# EAGLE design attiny84_bo (EAGLE 6.2)
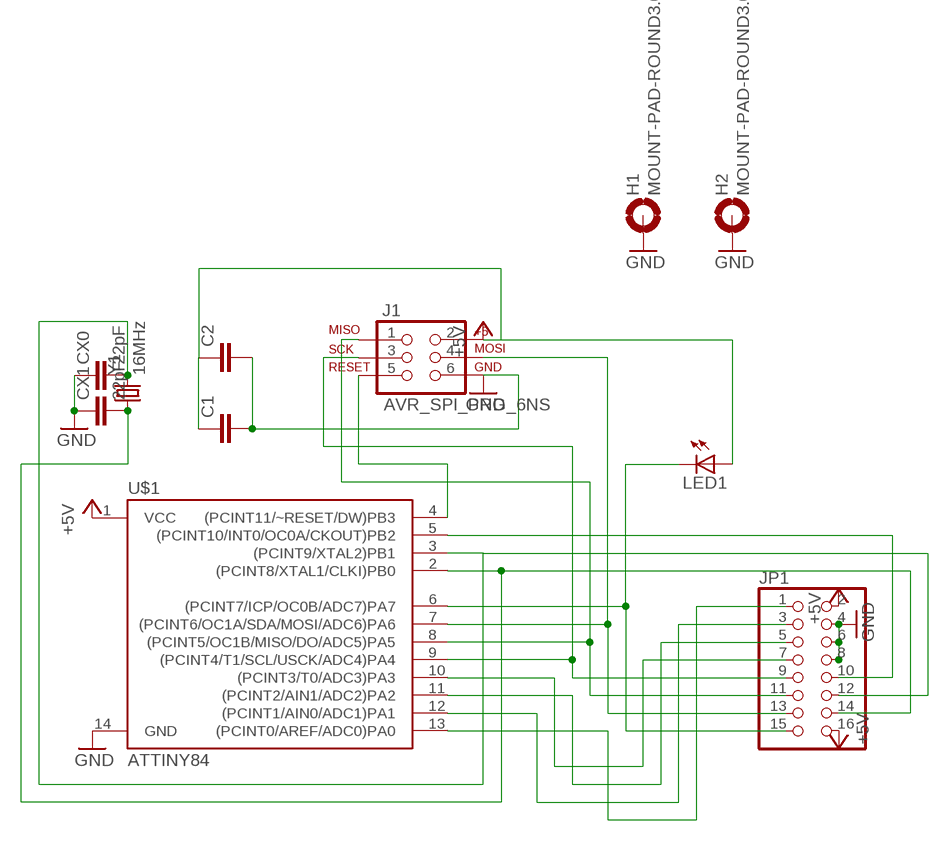
[diagram p0: schematic, sheet 1]

## Parts
C1  C-EUC0805  [C0805]
C2  C-EUC0805  [C0805]
CX0  22pF  C-EUC0603  [C0603]
CX1  22pF  C-EUC0603  [C0603]
H1  MOUNT-PAD-ROUND3.0  [3,0-PAD]
H2  MOUNT-PAD-ROUND3.0  [3,0-PAD]
J1  AVR_SPI_PRG_6NS  [2X3-NS]
JP1  PINHD-2X8  [2X08]
LED1  LED0603  [LED-0603]
U$1  ATTINY84  [SO14]
Y1  16MHz  CRYSTAL5X3  [CRYSTAL-SMD-5X3]

## Nets
+5V [POWER]: C1.1 C2.1 J1.2 JP1.2 JP1.16 LED1.A U$1.1(VCC)
GND [POWER]: C1.2 C2.2 CX0.1 CX1.1 H1.B3,0(MOUNT) H2.B3,0(MOUNT) J1.6 JP1.4 JP1.6 JP1.8 U$1.14(GND)
PA0: JP1.1 U$1.13((PCINT0/AREF/ADC0)PA0)
PA1: JP1.3 U$1.12((PCINT1/AIN0/ADC1)PA1)
PA2: JP1.5 U$1.11((PCINT2/AIN1/ADC2)PA2)
PA3: JP1.7 U$1.10((PCINT3/T0/ADC3)PA3)
PA4/SCL: J1.3 JP1.9 U$1.9((PCINT4/T1/SCL/USCK/ADC4)PA4)
PA5/MISO: J1.1 JP1.11 U$1.8((PCINT5/OC1B/MISO/DO/ADC5)PA5)
PA6/MOSI: J1.4 JP1.13 U$1.7((PCINT6/OC1A/SDA/MOSI/ADC6)PA6)
PA7: JP1.15 LED1.C U$1.6((PCINT7/ICP/OC0B/ADC7)PA7)
PB0/XTAL1: CX1.2 JP1.14 U$1.2((PCINT8/XTAL1/CLKI)PB0) Y1.1
PB1/XTAL2: CX0.2 JP1.12 U$1.3((PCINT9/XTAL2)PB1) Y1.3
PB2: JP1.10 U$1.5((PCINT10/INT0/OC0A/CKOUT)PB2)
PB3/RESET-: J1.5 U$1.4((PCINT11/~RESET/DW)PB3)

## Library data of the parts
C1 C2 CX0 CX1 = rcl:C-EU: CAPACITOR, European symbol
H1 H2 = holes:MOUNT-PAD-ROUND: MOUNTING PAD, round
J1 = SparkFun-Connectors:AVR_SPI_PRG_6: AVR ISP 6 Pin This is the reduced ISP connector for AVR programming. Common on Arduino. This footprint will take up less PCB space and can be used with a 10-pin to 6-pin adapter such as SKU: BOB-08508
JP1 = pinhead:PINHD-2X8: PIN HEADER
LED1 = SparkFun-LED:LED: LEDs Standard schematic elements and footprints for 5mm, 3mm, 1206, and 0603 sized LEDs. 5mm - Spark Fun Electronics SKU : COM-00529 (and others)
U$1 = SparkFun-DigitalIC:ATTINY84: Atmel 14-pin 2/4/8kB flash uC
Y1 = SparkFun-FreqCtrl:CRYSTAL: Various standard crystals. Proven footprints. Spark Fun Electronics SKU : COM-00534

## Net classes
1 POWER: width 0.254 mm

## Board
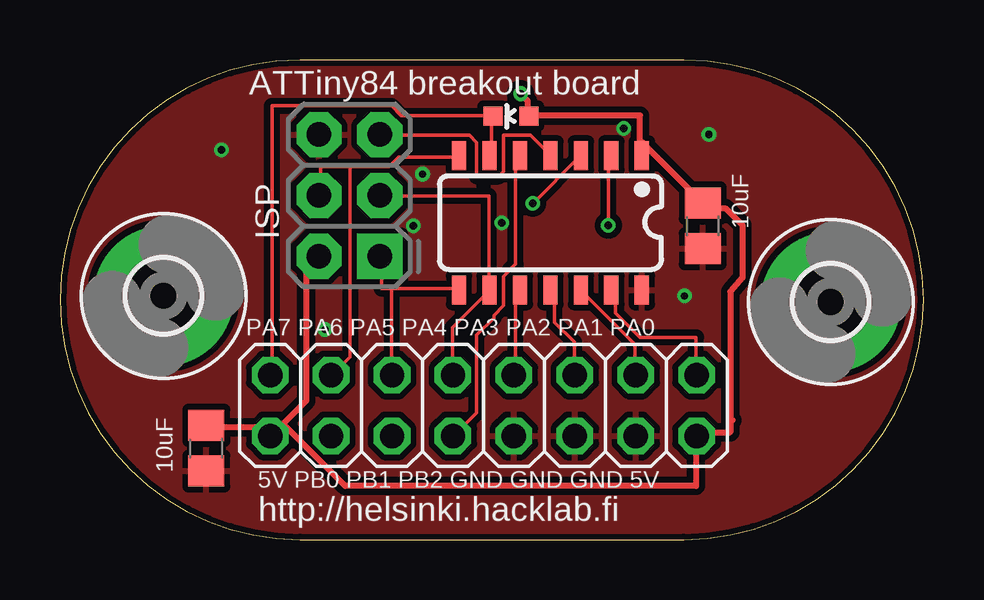
[diagram p1: board, top side]
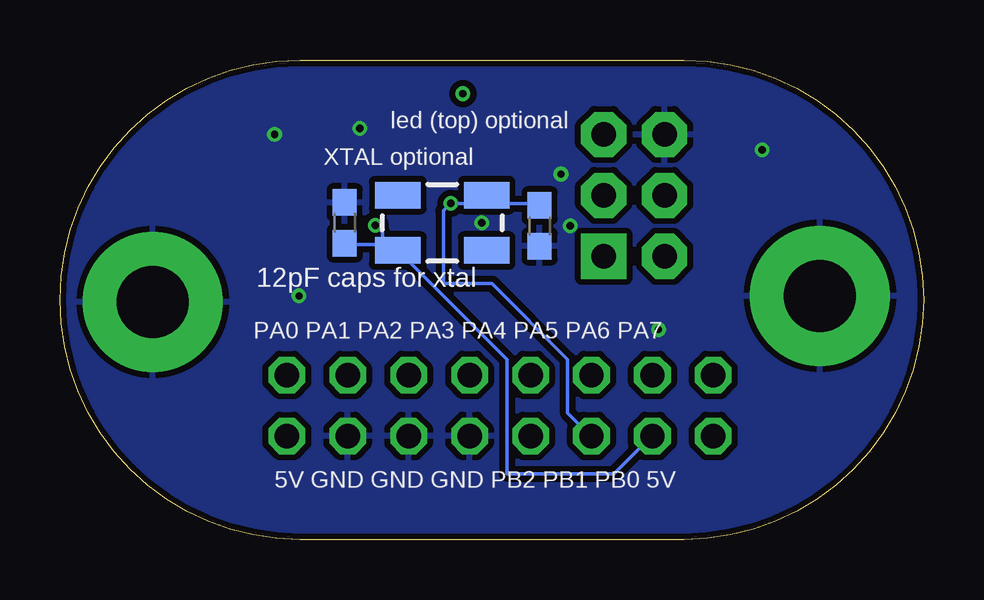
[diagram p2: board, bottom side, seen from below]

Size 36 x 20 mm. Coordinates in mm from the lower left corner, seen from the top.
Outline: 10,20 arc180 10,0 26,0 arc180 26,20 10,20
Copper layers (1*16): Top 0.035mm / dielectric 1.5mm / Bottom 0.035mm
Design rules "default": minimum track width 6mil, minimum drill 12mil, track to track 6mil, track to pad 6mil, pad to pad 6mil, via to via 6mil, smd to smd 0mil, copper to edge 10mil, drill to drill 10mil, minimum pad ring 10mil, minimum via ring 6mil, stop-mask expansion 2mil, vias tented up to drill 100mil, thermal gap 10mil

### Footprints (pad centres in the part's own frame; a part is rotated, then mirrored left to right if it is on the bottom)
C0805 = smd 1.3 x 1.5: 1 -0.95,0; 2 0.95,0
C0603 = smd 1.1 x 1: 1 -0.85,0; 2 0.85,0
3,0-PAD = drill 3 pad 5.842: B3,0 0,0
2X3-NS = drill 1.016 pad 1.88 square: 1 -2.54,-1.27 | drill 1.016 pad 1.88 octagon: 2 -2.54,1.27; 3 0,-1.27; 4 0,1.27; 5 2.54,-1.27; 6 2.54,1.27
2X08 = drill 1.016 octagon: 1 -8.89,-1.27; 2 -8.89,1.27; 3 -6.35,-1.27; 4 -6.35,1.27; 5 -3.81,-1.27; 6 -3.81,1.27; 7 -1.27,-1.27; 8 -1.27,1.27; 9 1.27,-1.27; 10 1.27,1.27; 11 3.81,-1.27; 12 3.81,1.27; 13 6.35,-1.27; 14 6.35,1.27; 15 8.89,-1.27; 16 8.89,1.27
LED-0603 = smd 0.8 x 0.8: A 0,-0.75; C 0,0.75
SO14 = smd 0.6 x 1.2: 1 -3.81,-2.8; 2 -2.54,-2.8; 3 -1.27,-2.8; 4 0,-2.8; 5 1.27,-2.8; 6 2.54,-2.8; 7 3.81,-2.8; 8 3.81,2.8; 9 2.54,2.8; 10 1.27,2.8; 11 0,2.8; 12 -1.27,2.8; 13 -2.54,2.8; 14 -3.81,2.8
CRYSTAL-SMD-5X3 = smd 1.9 x 1.1: 1 -1.85,-1.15; 2 1.85,-1.15; 3 1.85,1.15; 4 -1.85,1.15

### Placement (x,y rotation side)
C1  26.8,13.08 270 top
C2  6.1,3.81 270 top
CX0  16,13.08 90 bottom
CX1  24.13,13.21 270 bottom
H1  4.32,10.16 0 top
H2  32.13,9.91 0 top
J1  12.06,14.35 90 top
JP1  17.65,5.59 180 top
LED1  18.8,17.65 90 top
U$1  20.45,13.21 180 top
Y1  20.07,13.21 0 bottom

### Tracks (layer width: path | path; a pad name or v marks a point on that pad's centre or on a via)
+5V  (via drill 0.3)
  Top 0.254: 27.94,4.98 27.94,10.34 28.45,10.92 28.45,13.11 27.74,13.82 26.82,13.82 26.82,13.92 C1.1 26.72,14.12 24.28,16.56 U$1.1 24.18,16.05 24.18,17.68 19.61,17.68 LED1.A 19.51,17.68 19.51,18.29 v19.2,18.59 | 27.94,4.98 27.94,4.47 26.62,4.47 26.62,4.37 JP1.2 26.52,4.27 26.52,2.23 11.89,2.23 9.35,4.78 JP1.16 | 28.04,4.98 27.94,4.98 | JP1.16 8.84,4.37 10.26,5.79 10.26,5.89 10.26,11.28 10.77,11.79 J1.2 | C2.1 6.1,4.67 9.04,4.67 JP1.16
GND  (via drill 0.3)
  other vias: 26.04,10.16 6.73,16.26 27.05,16.89 11.05,8.76 15.11,15.24 14.73,13.08 23.5,17.14 18.41,13.21
  pour Top (isolate 0.254): 0,19.94 0,0 35.81,0 35.81,19.94
  pour Bottom (isolate 0.254): 0,19.94 0,0 35.81,0 35.81,19.94
PA0
  Top 0.152: U$1.13 23.06,10.36 23.16,10.26 23.16,9.45 24.18,8.43 26.52,8.43 26.52,6.91 JP1.1
PA1
  Top 0.152: U$1.12 21.74,10.36 23.98,8.13 23.98,6.91 JP1.3
PA2
  Top 0.152: U$1.11 20.52,10.36 20.62,10.26 20.62,9.04 21.44,8.23 21.44,6.91 JP1.5
PA3
  Top 0.152: U$1.10 19.1,10.36 19,10.26 19,6.91 JP1.7
PA4/SCL
  Top 0.152: JP1.9 16.36,6.91 16.36,8.84 17.88,10.36 U$1.9 17.88,10.46 17.88,13.31 17.88,14.33 13.41,14.33 J1.3
PA5/MISO
  Top 0.152: 16.56,10.46 U$1.8 16.56,10.46 | 13.82,6.91 JP1.11 13.82,6.91 | 13.82,10.46 13.41,10.46 13.41,11.79 J1.1 | 13.82,10.46 16.56,10.46 | 13.82,10.46 13.82,6.91
PA6/MOSI
  Top 0.152: U$1.7 16.56,15.95 15.85,15.95 14.12,15.95 13.72,15.54 12.09,15.54 | JP1.13 11.38,6.91 12.09,7.62 12.09,15.54 | 12.09,15.54 10.87,15.54 10.87,14.43 J1.4
PA7
  Top 0.152: LED1.C 17.98,17.58 17.98,16.05 U$1.6 | 17.98,17.68 LED1.C | 8.74,6.91 JP1.15 8.84,6.91 8.84,18.09 13.82,18.09 14.22,17.68 17.98,17.68 | 17.98,17.68 LED1.C
PB0/XTAL1  (via drill 0.3)
  Top 0.152: v22.86,13.11 22.86,15.85 22.96,15.95 U$1.2
  Bottom 0.152: 22.55,12.29 21.95,12.29 21.95,12.09 Y1.1 | 22.55,12.29 24.08,12.29 CX1.2 | v22.86,13.11 22.55,12.8 22.55,12.29 | 22.55,12.29 Y1.1 | JP1.14 11.38,4.27 12.9,2.74 17.37,2.74 17.37,7.52 21.84,11.99 Y1.1
PB1/XTAL2  (via drill 0.3)
  Top 0.152: v19.71,14.02 21.64,15.95 U$1.3
  Bottom 0.152: 18.19,14.02 16.05,14.02 CX0.2 | 18.19,14.02 18.19,14.33 Y1.3 18.19,14.02 | 18.19,14.02 v19.71,14.02 20.02,13.72 20.02,10.67 17.98,10.67 14.83,7.52 14.83,5.28 13.92,4.37 JP1.12
PB2
  Top 0.152: U$1.5 19.1,15.95 19,15.85 19,11.48 18.49,10.97 18.49,9.75 18.09,9.35 18.09,9.25 17.37,8.53 17.37,5.28 16.46,4.37 JP1.10
PB3/RESET-
  Top 0.152: U$1.4 20.42,16.05 19.61,16.87 18.49,16.87 18.49,15.34 18.29,15.14 17.37,15.14 17.37,16.56 17.07,16.87 13.41,16.87 J1.5

### Text on the board
tNames: ATTiny84 breakout board | ISP | 10uF | PA7 PA6 PA5 PA4 PA3 PA2 PA1 PA0 | 10uF | 5V PB0 PB1 PB2 GND GND GND 5V | http://helsinki.hacklab.fi
bNames: led (top) optional | XTAL optional | 12pF caps for xtal | PA0 PA1 PA2 PA3 PA4 PA5 PA6 PA7 | 5V GND GND GND PB2 PB1 PB0 5V